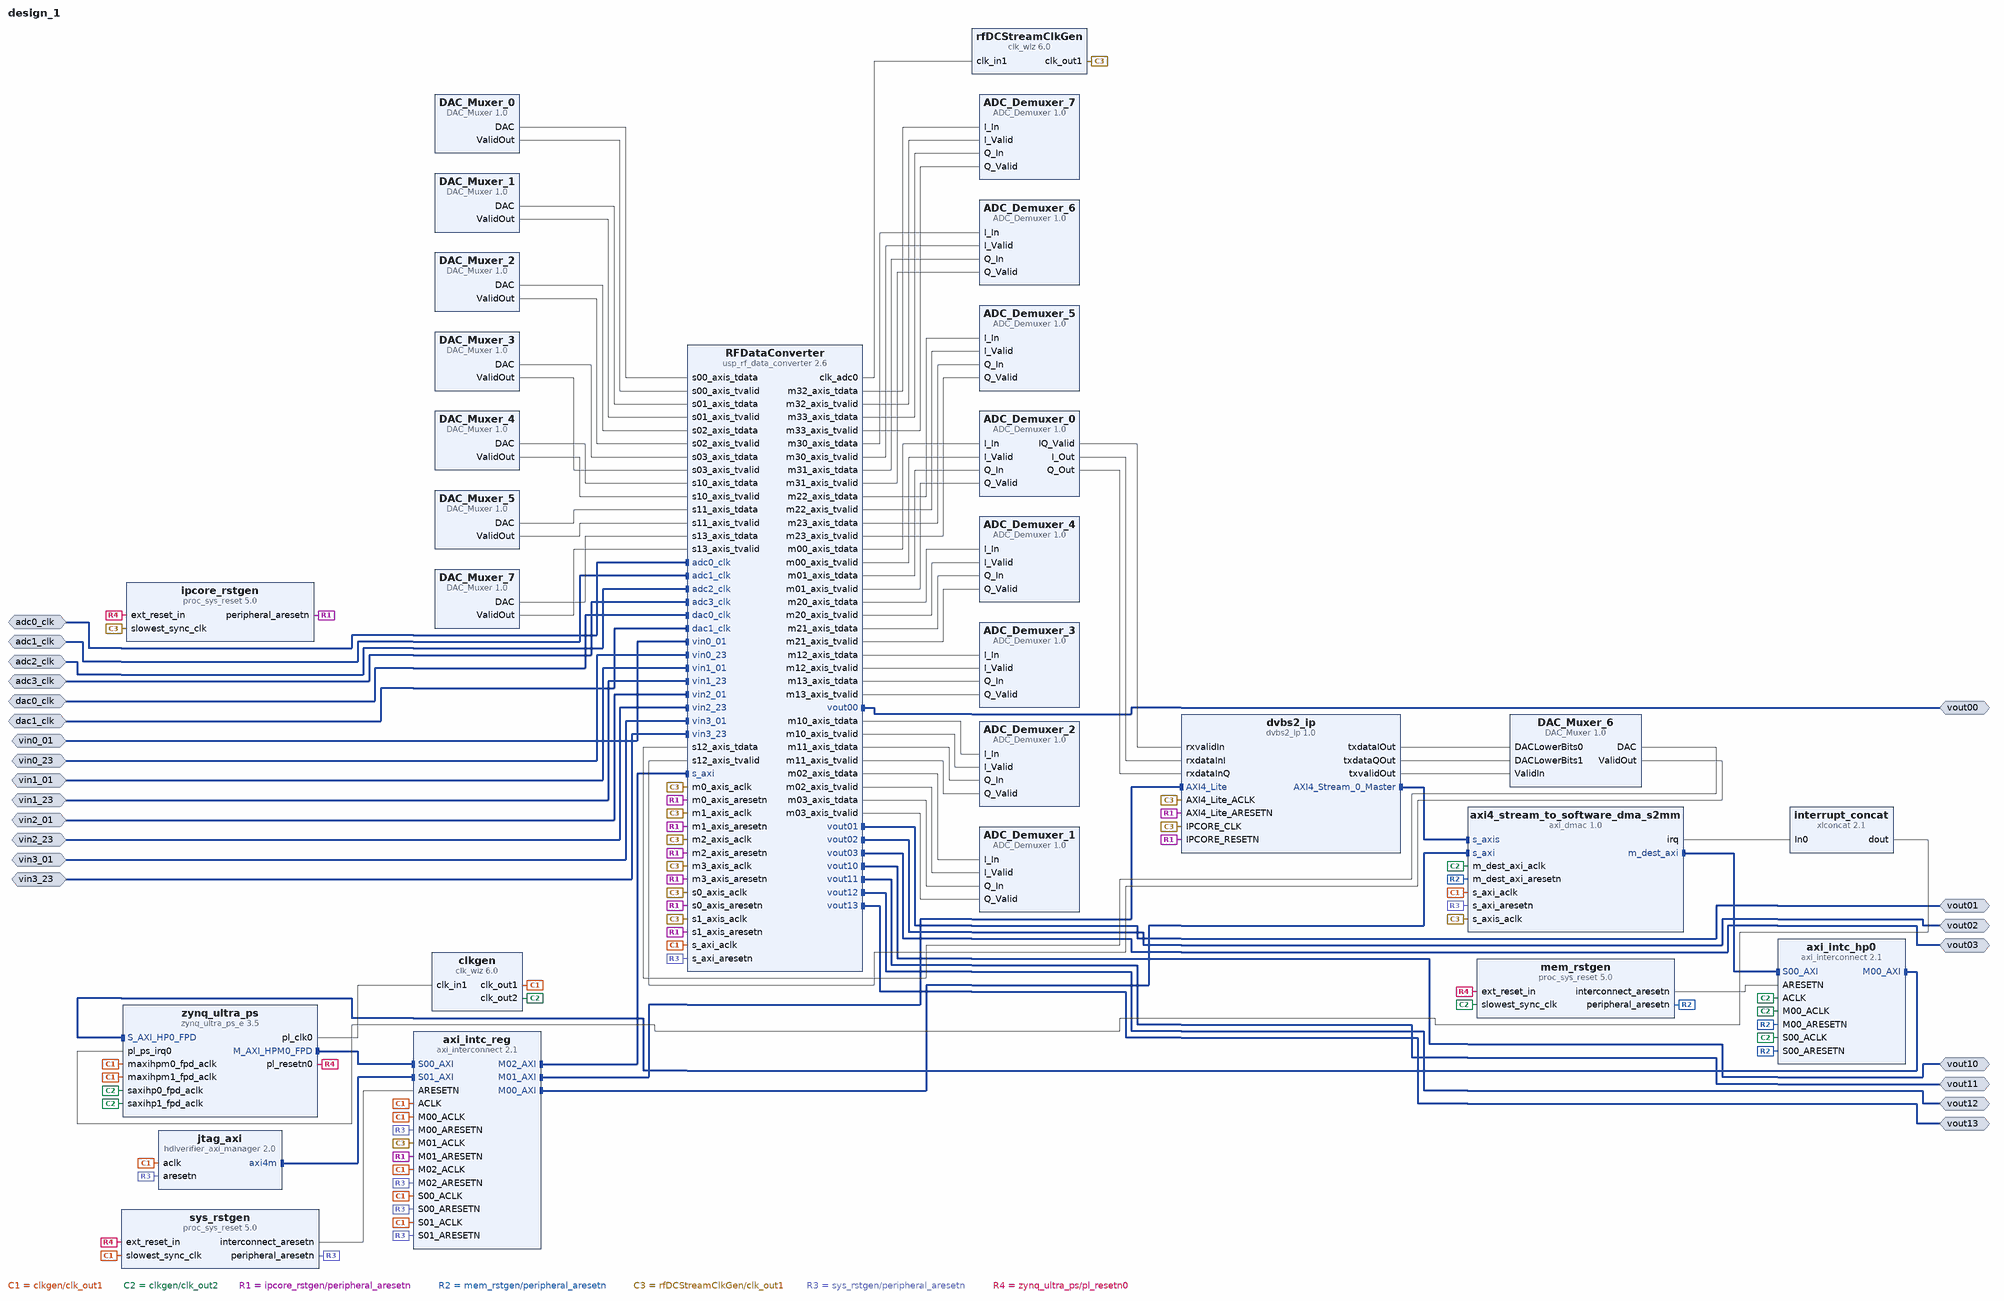
[diagram p0: block diagram of the top level]
# Vivado block design design_1, xczu28dr-ffvg1517-2-e, Vivado 2024.1
create_bd_design design_1

create_bd_intf_port -mode Slave -vlnv xilinx.com:interface:diff_clock_rtl:1.0 adc0_clk
create_bd_intf_port -mode Slave -vlnv xilinx.com:interface:diff_clock_rtl:1.0 adc1_clk
create_bd_intf_port -mode Slave -vlnv xilinx.com:interface:diff_clock_rtl:1.0 adc2_clk
create_bd_intf_port -mode Slave -vlnv xilinx.com:interface:diff_clock_rtl:1.0 adc3_clk
create_bd_intf_port -mode Slave -vlnv xilinx.com:interface:diff_analog_io_rtl:1.0 vin0_01
create_bd_intf_port -mode Slave -vlnv xilinx.com:interface:diff_analog_io_rtl:1.0 vin0_23
create_bd_intf_port -mode Slave -vlnv xilinx.com:interface:diff_analog_io_rtl:1.0 vin1_01
create_bd_intf_port -mode Slave -vlnv xilinx.com:interface:diff_analog_io_rtl:1.0 vin1_23
create_bd_intf_port -mode Slave -vlnv xilinx.com:interface:diff_analog_io_rtl:1.0 vin2_01
create_bd_intf_port -mode Slave -vlnv xilinx.com:interface:diff_analog_io_rtl:1.0 vin2_23
create_bd_intf_port -mode Slave -vlnv xilinx.com:interface:diff_analog_io_rtl:1.0 vin3_01
create_bd_intf_port -mode Slave -vlnv xilinx.com:interface:diff_analog_io_rtl:1.0 vin3_23
create_bd_intf_port -mode Slave -vlnv xilinx.com:interface:diff_clock_rtl:1.0 dac0_clk
create_bd_intf_port -mode Slave -vlnv xilinx.com:interface:diff_clock_rtl:1.0 dac1_clk
create_bd_intf_port -mode Master -vlnv xilinx.com:interface:diff_analog_io_rtl:1.0 vout00
create_bd_intf_port -mode Master -vlnv xilinx.com:interface:diff_analog_io_rtl:1.0 vout01
create_bd_intf_port -mode Master -vlnv xilinx.com:interface:diff_analog_io_rtl:1.0 vout02
create_bd_intf_port -mode Master -vlnv xilinx.com:interface:diff_analog_io_rtl:1.0 vout03
create_bd_intf_port -mode Master -vlnv xilinx.com:interface:diff_analog_io_rtl:1.0 vout10
create_bd_intf_port -mode Master -vlnv xilinx.com:interface:diff_analog_io_rtl:1.0 vout11
create_bd_intf_port -mode Master -vlnv xilinx.com:interface:diff_analog_io_rtl:1.0 vout12
create_bd_intf_port -mode Master -vlnv xilinx.com:interface:diff_analog_io_rtl:1.0 vout13

create_bd_cell -type ip -vlnv xilinx.com:ip:zynq_ultra_ps_e:3.5 zynq_ultra_ps
set_property -dict [list \
  CONFIG.CAN0_BOARD_INTERFACE custom \
  CONFIG.CAN1_BOARD_INTERFACE custom \
  CONFIG.CSU_BOARD_INTERFACE custom \
  CONFIG.DP_BOARD_INTERFACE custom \
  CONFIG.GEM0_BOARD_INTERFACE custom \
  CONFIG.GEM1_BOARD_INTERFACE custom \
  CONFIG.GEM2_BOARD_INTERFACE custom \
  CONFIG.GEM3_BOARD_INTERFACE custom \
  CONFIG.GPIO_BOARD_INTERFACE custom \
  CONFIG.IIC0_BOARD_INTERFACE custom \
  CONFIG.IIC1_BOARD_INTERFACE custom \
  CONFIG.NAND_BOARD_INTERFACE custom \
  CONFIG.PCIE_BOARD_INTERFACE custom \
  CONFIG.PJTAG_BOARD_INTERFACE custom \
  CONFIG.PMU_BOARD_INTERFACE custom \
  CONFIG.PSU_BANK_0_IO_STANDARD LVCMOS18 \
  CONFIG.PSU_BANK_1_IO_STANDARD LVCMOS18 \
  CONFIG.PSU_BANK_2_IO_STANDARD LVCMOS18 \
  CONFIG.PSU_BANK_3_IO_STANDARD LVCMOS33 \
  CONFIG.PSU_USB3__DUAL_CLOCK_ENABLE 1 \
  CONFIG.PSU__CAN1__PERIPHERAL__ENABLE 0 \
  CONFIG.PSU__CRF_APB__ACPU_CTRL__FREQMHZ 1200 \
  CONFIG.PSU__CRF_APB__ACPU_CTRL__SRCSEL APLL \
  CONFIG.PSU__CRF_APB__APLL_CTRL__SRCSEL PSS_REF_CLK \
  CONFIG.PSU__CRF_APB__DBG_FPD_CTRL__FREQMHZ 250 \
  CONFIG.PSU__CRF_APB__DBG_FPD_CTRL__SRCSEL IOPLL \
  CONFIG.PSU__CRF_APB__DBG_TRACE_CTRL__FREQMHZ 250 \
  CONFIG.PSU__CRF_APB__DBG_TRACE_CTRL__SRCSEL IOPLL \
  CONFIG.PSU__CRF_APB__DBG_TSTMP_CTRL__FREQMHZ 250 \
  CONFIG.PSU__CRF_APB__DBG_TSTMP_CTRL__SRCSEL IOPLL \
  CONFIG.PSU__CRF_APB__DDR_CTRL__FREQMHZ 1067 \
  CONFIG.PSU__CRF_APB__DDR_CTRL__SRCSEL DPLL \
  CONFIG.PSU__CRF_APB__DPDMA_REF_CTRL__FREQMHZ 600 \
  CONFIG.PSU__CRF_APB__DPDMA_REF_CTRL__SRCSEL APLL \
  CONFIG.PSU__CRF_APB__DPLL_CTRL__SRCSEL PSS_REF_CLK \
  CONFIG.PSU__CRF_APB__DP_AUDIO_REF_CTRL__SRCSEL RPLL \
  CONFIG.PSU__CRF_APB__DP_STC_REF_CTRL__SRCSEL RPLL \
  CONFIG.PSU__CRF_APB__DP_VIDEO_REF_CTRL__SRCSEL VPLL \
  CONFIG.PSU__CRF_APB__GDMA_REF_CTRL__FREQMHZ 600 \
  CONFIG.PSU__CRF_APB__GDMA_REF_CTRL__SRCSEL APLL \
  CONFIG.PSU__CRF_APB__GPU_REF_CTRL__FREQMHZ 500 \
  CONFIG.PSU__CRF_APB__GPU_REF_CTRL__SRCSEL IOPLL \
  CONFIG.PSU__CRF_APB__TOPSW_LSBUS_CTRL__FREQMHZ 100 \
  CONFIG.PSU__CRF_APB__TOPSW_LSBUS_CTRL__SRCSEL IOPLL \
  CONFIG.PSU__CRF_APB__TOPSW_MAIN_CTRL__FREQMHZ 533.33 \
  CONFIG.PSU__CRF_APB__TOPSW_MAIN_CTRL__SRCSEL DPLL \
  CONFIG.PSU__CRF_APB__VPLL_CTRL__SRCSEL PSS_REF_CLK \
  CONFIG.PSU__CRL_APB__ADMA_REF_CTRL__FREQMHZ 500 \
  CONFIG.PSU__CRL_APB__ADMA_REF_CTRL__SRCSEL IOPLL \
  CONFIG.PSU__CRL_APB__CAN1_REF_CTRL__FREQMHZ 100 \
  CONFIG.PSU__CRL_APB__CAN1_REF_CTRL__SRCSEL IOPLL \
  CONFIG.PSU__CRL_APB__CPU_R5_CTRL__FREQMHZ 500 \
  CONFIG.PSU__CRL_APB__CPU_R5_CTRL__SRCSEL IOPLL \
  CONFIG.PSU__CRL_APB__DBG_LPD_CTRL__FREQMHZ 250 \
  CONFIG.PSU__CRL_APB__DBG_LPD_CTRL__SRCSEL IOPLL \
  CONFIG.PSU__CRL_APB__GEM3_REF_CTRL__FREQMHZ 125 \
  CONFIG.PSU__CRL_APB__GEM3_REF_CTRL__SRCSEL IOPLL \
  CONFIG.PSU__CRL_APB__I2C0_REF_CTRL__FREQMHZ 100 \
  CONFIG.PSU__CRL_APB__I2C0_REF_CTRL__SRCSEL IOPLL \
  CONFIG.PSU__CRL_APB__I2C1_REF_CTRL__FREQMHZ 100 \
  CONFIG.PSU__CRL_APB__I2C1_REF_CTRL__SRCSEL IOPLL \
  CONFIG.PSU__CRL_APB__IOPLL_CTRL__SRCSEL PSS_REF_CLK \
  CONFIG.PSU__CRL_APB__IOU_SWITCH_CTRL__FREQMHZ 250 \
  CONFIG.PSU__CRL_APB__IOU_SWITCH_CTRL__SRCSEL IOPLL \
  CONFIG.PSU__CRL_APB__LPD_LSBUS_CTRL__FREQMHZ 100 \
  CONFIG.PSU__CRL_APB__LPD_LSBUS_CTRL__SRCSEL IOPLL \
  CONFIG.PSU__CRL_APB__LPD_SWITCH_CTRL__FREQMHZ 500 \
  CONFIG.PSU__CRL_APB__LPD_SWITCH_CTRL__SRCSEL IOPLL \
  CONFIG.PSU__CRL_APB__PCAP_CTRL__FREQMHZ 200 \
  CONFIG.PSU__CRL_APB__PCAP_CTRL__SRCSEL IOPLL \
  CONFIG.PSU__CRL_APB__PL0_REF_CTRL__FREQMHZ 100 \
  CONFIG.PSU__CRL_APB__PL0_REF_CTRL__SRCSEL IOPLL \
  CONFIG.PSU__CRL_APB__QSPI_REF_CTRL__FREQMHZ 125 \
  CONFIG.PSU__CRL_APB__QSPI_REF_CTRL__SRCSEL IOPLL \
  CONFIG.PSU__CRL_APB__RPLL_CTRL__SRCSEL PSS_REF_CLK \
  CONFIG.PSU__CRL_APB__SDIO1_REF_CTRL__FREQMHZ 200 \
  CONFIG.PSU__CRL_APB__SDIO1_REF_CTRL__SRCSEL IOPLL \
  CONFIG.PSU__CRL_APB__TIMESTAMP_REF_CTRL__FREQMHZ 100 \
  CONFIG.PSU__CRL_APB__TIMESTAMP_REF_CTRL__SRCSEL IOPLL \
  CONFIG.PSU__CRL_APB__UART0_REF_CTRL__FREQMHZ 100 \
  CONFIG.PSU__CRL_APB__UART0_REF_CTRL__SRCSEL IOPLL \
  CONFIG.PSU__CRL_APB__UART1_REF_CTRL__FREQMHZ 100 \
  CONFIG.PSU__CRL_APB__UART1_REF_CTRL__SRCSEL IOPLL \
  CONFIG.PSU__CRL_APB__USB0_BUS_REF_CTRL__FREQMHZ 250 \
  CONFIG.PSU__CRL_APB__USB0_BUS_REF_CTRL__SRCSEL IOPLL \
  CONFIG.PSU__CRL_APB__USB3_DUAL_REF_CTRL__FREQMHZ 20 \
  CONFIG.PSU__CRL_APB__USB3_DUAL_REF_CTRL__SRCSEL IOPLL \
  CONFIG.PSU__CRL_APB__USB3__ENABLE 1 \
  CONFIG.PSU__CSUPMU__PERIPHERAL__VALID 1 \
  CONFIG.PSU__DDRC__BUS_WIDTH {64 Bit} \
  CONFIG.PSU__DDRC__COMPONENTS UDIMM \
  CONFIG.PSU__DDRC__DEVICE_CAPACITY {8192 MBits} \
  CONFIG.PSU__DDRC__DRAM_WIDTH {16 Bits} \
  CONFIG.PSU__DDRC__ECC Disabled \
  CONFIG.PSU__DDRC__MEMORY_TYPE {DDR 4} \
  CONFIG.PSU__DDRC__SPEED_BIN DDR4_2133P \
  CONFIG.PSU__DDR_HIGH_ADDRESS_GUI_ENABLE 1 \
  CONFIG.PSU__DDR__INTERFACE__FREQMHZ 533.500 \
  CONFIG.PSU__DEVICE_TYPE RFSOC \
  CONFIG.PSU__DISPLAYPORT__LANE0__ENABLE 1 \
  CONFIG.PSU__DISPLAYPORT__LANE0__IO {GT Lane1} \
  CONFIG.PSU__DISPLAYPORT__LANE1__ENABLE 1 \
  CONFIG.PSU__DISPLAYPORT__LANE1__IO {GT Lane0} \
  CONFIG.PSU__DISPLAYPORT__PERIPHERAL__ENABLE 1 \
  CONFIG.PSU__DLL__ISUSED 1 \
  CONFIG.PSU__DPAUX__PERIPHERAL__ENABLE 1 \
  CONFIG.PSU__DPAUX__PERIPHERAL__IO {MIO 27 .. 30} \
  CONFIG.PSU__DP__LANE_SEL {Dual Lower} \
  CONFIG.PSU__DP__REF_CLK_FREQ 27 \
  CONFIG.PSU__DP__REF_CLK_SEL {Ref Clk1} \
  CONFIG.PSU__ENET3__FIFO__ENABLE 0 \
  CONFIG.PSU__ENET3__GRP_MDIO__ENABLE 1 \
  CONFIG.PSU__ENET3__GRP_MDIO__IO {MIO 76 .. 77} \
  CONFIG.PSU__ENET3__PERIPHERAL__ENABLE 1 \
  CONFIG.PSU__ENET3__PERIPHERAL__IO {MIO 64 .. 75} \
  CONFIG.PSU__ENET3__PTP__ENABLE 0 \
  CONFIG.PSU__ENET3__TSU__ENABLE 0 \
  CONFIG.PSU__FPGA_PL0_ENABLE 1 \
  CONFIG.PSU__GEM3_COHERENCY 0 \
  CONFIG.PSU__GEM3_ROUTE_THROUGH_FPD 0 \
  CONFIG.PSU__GEM__TSU__ENABLE 0 \
  CONFIG.PSU__GPIO0_MIO__IO {MIO 0 .. 25} \
  CONFIG.PSU__GPIO0_MIO__PERIPHERAL__ENABLE 1 \
  CONFIG.PSU__GPIO1_MIO__IO {MIO 26 .. 51} \
  CONFIG.PSU__GPIO1_MIO__PERIPHERAL__ENABLE 1 \
  CONFIG.PSU__GPU_PP0__POWER__ON 0 \
  CONFIG.PSU__GPU_PP1__POWER__ON 0 \
  CONFIG.PSU__GT__LINK_SPEED HBR \
  CONFIG.PSU__GT__PRE_EMPH_LVL_4 0 \
  CONFIG.PSU__GT__VLT_SWNG_LVL_4 0 \
  CONFIG.PSU__I2C0__PERIPHERAL__ENABLE 1 \
  CONFIG.PSU__I2C0__PERIPHERAL__IO {MIO 14 .. 15} \
  CONFIG.PSU__I2C1__PERIPHERAL__ENABLE 1 \
  CONFIG.PSU__I2C1__PERIPHERAL__IO {MIO 16 .. 17} \
  CONFIG.PSU__IOU_SLCR__IOU_TTC_APB_CLK__TTC0_SEL APB \
  CONFIG.PSU__IOU_SLCR__IOU_TTC_APB_CLK__TTC1_SEL APB \
  CONFIG.PSU__IOU_SLCR__IOU_TTC_APB_CLK__TTC2_SEL APB \
  CONFIG.PSU__IOU_SLCR__IOU_TTC_APB_CLK__TTC3_SEL APB \
  CONFIG.PSU__MAXIGP0__DATA_WIDTH 128 \
  CONFIG.PSU__OVERRIDE__BASIC_CLOCK 0 \
  CONFIG.PSU__PCIE__CLASS_CODE_BASE 0x06 \
  CONFIG.PSU__PCIE__CLASS_CODE_INTERFACE 0x0 \
  CONFIG.PSU__PCIE__CLASS_CODE_SUB 0x4 \
  CONFIG.PSU__PCIE__DEVICE_ID 0xD021 \
  CONFIG.PSU__PCIE__REVISION_ID 0x0 \
  CONFIG.PSU__PCIE__SUBSYSTEM_ID 0x7 \
  CONFIG.PSU__PCIE__SUBSYSTEM_VENDOR_ID 0x10EE \
  CONFIG.PSU__PCIE__VENDOR_ID 0x10EE \
  CONFIG.PSU__PMU_COHERENCY 0 \
  CONFIG.PSU__PMU__AIBACK__ENABLE 0 \
  CONFIG.PSU__PMU__EMIO_GPI__ENABLE 0 \
  CONFIG.PSU__PMU__EMIO_GPO__ENABLE 0 \
  CONFIG.PSU__PMU__GPI0__ENABLE 0 \
  CONFIG.PSU__PMU__GPI1__ENABLE 0 \
  CONFIG.PSU__PMU__GPI2__ENABLE 0 \
  CONFIG.PSU__PMU__GPI3__ENABLE 0 \
  CONFIG.PSU__PMU__GPI4__ENABLE 0 \
  CONFIG.PSU__PMU__GPI5__ENABLE 0 \
  CONFIG.PSU__PMU__GPO0__ENABLE 1 \
  CONFIG.PSU__PMU__GPO0__IO {MIO 32} \
  CONFIG.PSU__PMU__GPO1__ENABLE 1 \
  CONFIG.PSU__PMU__GPO1__IO {MIO 33} \
  CONFIG.PSU__PMU__GPO2__ENABLE 1 \
  CONFIG.PSU__PMU__GPO2__IO {MIO 34} \
  CONFIG.PSU__PMU__GPO2__POLARITY low \
  CONFIG.PSU__PMU__GPO3__ENABLE 1 \
  CONFIG.PSU__PMU__GPO3__IO {MIO 35} \
  CONFIG.PSU__PMU__GPO3__POLARITY low \
  CONFIG.PSU__PMU__GPO4__ENABLE 1 \
  CONFIG.PSU__PMU__GPO4__IO {MIO 36} \
  CONFIG.PSU__PMU__GPO4__POLARITY low \
  CONFIG.PSU__PMU__GPO5__ENABLE 1 \
  CONFIG.PSU__PMU__GPO5__IO {MIO 37} \
  CONFIG.PSU__PMU__GPO5__POLARITY low \
  CONFIG.PSU__PMU__PERIPHERAL__ENABLE 1 \
  CONFIG.PSU__PMU__PLERROR__ENABLE 0 \
  CONFIG.PSU__PRESET_APPLIED 1 \
  CONFIG.PSU__PSS_REF_CLK__FREQMHZ 33.333 \
  CONFIG.PSU__QSPI_COHERENCY 0 \
  CONFIG.PSU__QSPI_ROUTE_THROUGH_FPD 0 \
  CONFIG.PSU__QSPI__GRP_FBCLK__ENABLE 1 \
  CONFIG.PSU__QSPI__GRP_FBCLK__IO {MIO 6} \
  CONFIG.PSU__QSPI__PERIPHERAL__DATA_MODE x4 \
  CONFIG.PSU__QSPI__PERIPHERAL__ENABLE 1 \
  CONFIG.PSU__QSPI__PERIPHERAL__IO {MIO 0 .. 12} \
  CONFIG.PSU__QSPI__PERIPHERAL__MODE {Dual Parallel} \
  CONFIG.PSU__SATA__LANE1__IO {GT Lane3} \
  CONFIG.PSU__SATA__PERIPHERAL__ENABLE 1 \
  CONFIG.PSU__SATA__REF_CLK_FREQ 125 \
  CONFIG.PSU__SATA__REF_CLK_SEL {Ref Clk3} \
  CONFIG.PSU__SD1_COHERENCY 0 \
  CONFIG.PSU__SD1_ROUTE_THROUGH_FPD 0 \
  CONFIG.PSU__SD1__CLK_100_SDR_OTAP_DLY 0x3 \
  CONFIG.PSU__SD1__CLK_200_SDR_OTAP_DLY 0x3 \
  CONFIG.PSU__SD1__CLK_50_DDR_ITAP_DLY 0x3D \
  CONFIG.PSU__SD1__CLK_50_DDR_OTAP_DLY 0x4 \
  CONFIG.PSU__SD1__CLK_50_SDR_ITAP_DLY 0x15 \
  CONFIG.PSU__SD1__CLK_50_SDR_OTAP_DLY 0x5 \
  CONFIG.PSU__SD1__DATA_TRANSFER_MODE 8Bit \
  CONFIG.PSU__SD1__GRP_CD__ENABLE 1 \
  CONFIG.PSU__SD1__GRP_CD__IO {MIO 45} \
  CONFIG.PSU__SD1__GRP_POW__ENABLE 0 \
  CONFIG.PSU__SD1__GRP_WP__ENABLE 0 \
  CONFIG.PSU__SD1__PERIPHERAL__ENABLE 1 \
  CONFIG.PSU__SD1__PERIPHERAL__IO {MIO 39 .. 51} \
  CONFIG.PSU__SD1__SLOT_TYPE {SD 3.0} \
  CONFIG.PSU__SWDT0__CLOCK__ENABLE 0 \
  CONFIG.PSU__SWDT0__PERIPHERAL__ENABLE 1 \
  CONFIG.PSU__SWDT0__RESET__ENABLE 0 \
  CONFIG.PSU__SWDT1__CLOCK__ENABLE 0 \
  CONFIG.PSU__SWDT1__PERIPHERAL__ENABLE 1 \
  CONFIG.PSU__SWDT1__RESET__ENABLE 0 \
  CONFIG.PSU__TSU__BUFG_PORT_PAIR 0 \
  CONFIG.PSU__TTC0__CLOCK__ENABLE 0 \
  CONFIG.PSU__TTC0__PERIPHERAL__ENABLE 1 \
  CONFIG.PSU__TTC0__WAVEOUT__ENABLE 0 \
  CONFIG.PSU__TTC1__CLOCK__ENABLE 0 \
  CONFIG.PSU__TTC1__PERIPHERAL__ENABLE 1 \
  CONFIG.PSU__TTC1__WAVEOUT__ENABLE 0 \
  CONFIG.PSU__TTC2__CLOCK__ENABLE 0 \
  CONFIG.PSU__TTC2__PERIPHERAL__ENABLE 1 \
  CONFIG.PSU__TTC2__WAVEOUT__ENABLE 0 \
  CONFIG.PSU__TTC3__CLOCK__ENABLE 0 \
  CONFIG.PSU__TTC3__PERIPHERAL__ENABLE 1 \
  CONFIG.PSU__TTC3__WAVEOUT__ENABLE 0 \
  CONFIG.PSU__UART0__BAUD_RATE 115200 \
  CONFIG.PSU__UART0__MODEM__ENABLE 0 \
  CONFIG.PSU__UART0__PERIPHERAL__ENABLE 1 \
  CONFIG.PSU__UART0__PERIPHERAL__IO {MIO 18 .. 19} \
  CONFIG.PSU__UART1__PERIPHERAL__ENABLE 0 \
  CONFIG.PSU__USB0_COHERENCY 0 \
  CONFIG.PSU__USB0__PERIPHERAL__ENABLE 1 \
  CONFIG.PSU__USB0__PERIPHERAL__IO {MIO 52 .. 63} \
  CONFIG.PSU__USB0__REF_CLK_FREQ 26 \
  CONFIG.PSU__USB0__REF_CLK_SEL {Ref Clk2} \
  CONFIG.PSU__USB2_0__EMIO__ENABLE 0 \
  CONFIG.PSU__USB3_0__EMIO__ENABLE 0 \
  CONFIG.PSU__USB3_0__PERIPHERAL__ENABLE 1 \
  CONFIG.PSU__USB3_0__PERIPHERAL__IO {GT Lane2} \
  CONFIG.PSU__USB__RESET__MODE {Boot Pin} \
  CONFIG.PSU__USB__RESET__POLARITY {Active Low} \
  CONFIG.PSU__USE__IRQ0 1 \
  CONFIG.PSU__USE__IRQ1 1 \
  CONFIG.PSU__USE__M_AXI_GP0 1 \
  CONFIG.PSU__USE__M_AXI_GP1 1 \
  CONFIG.PSU__USE__M_AXI_GP2 0 \
  CONFIG.PSU__USE__S_AXI_GP2 1 \
  CONFIG.PSU__USE__S_AXI_GP3 1 \
  CONFIG.QSPI_BOARD_INTERFACE custom \
  CONFIG.SATA_BOARD_INTERFACE custom \
  CONFIG.SD0_BOARD_INTERFACE custom \
  CONFIG.SD1_BOARD_INTERFACE custom \
  CONFIG.SPI0_BOARD_INTERFACE custom \
  CONFIG.SPI1_BOARD_INTERFACE custom \
  CONFIG.SUBPRESET1 Custom \
  CONFIG.SUBPRESET2 Custom \
  CONFIG.SWDT0_BOARD_INTERFACE custom \
  CONFIG.SWDT1_BOARD_INTERFACE custom \
  CONFIG.TRACE_BOARD_INTERFACE custom \
  CONFIG.TTC0_BOARD_INTERFACE custom \
  CONFIG.TTC1_BOARD_INTERFACE custom \
  CONFIG.TTC2_BOARD_INTERFACE custom \
  CONFIG.TTC3_BOARD_INTERFACE custom \
  CONFIG.UART0_BOARD_INTERFACE custom \
  CONFIG.UART1_BOARD_INTERFACE custom \
  CONFIG.USB0_BOARD_INTERFACE custom \
  CONFIG.USB1_BOARD_INTERFACE custom \
] [get_bd_cells zynq_ultra_ps]
# 736 more settings of zynq_ultra_ps are not shown: defaults, MIO pin electricals, DDR timing, and values the tool derives
create_bd_cell -type ip -vlnv xilinx.com:ip:usp_rf_data_converter:2.6 RFDataConverter
set_property -dict [list \
  CONFIG.ADC0_Multi_Tile_Sync false \
  CONFIG.ADC0_Outclk_Freq 128.000 \
  CONFIG.ADC0_PLL_Enable true \
  CONFIG.ADC0_Sampling_Rate 2.04800000 \
  CONFIG.ADC1_Outclk_Freq 128.000 \
  CONFIG.ADC1_PLL_Enable true \
  CONFIG.ADC1_Sampling_Rate 2.04800000 \
  CONFIG.ADC2_Outclk_Freq 128.000 \
  CONFIG.ADC2_PLL_Enable true \
  CONFIG.ADC2_Sampling_Rate 2.04800000 \
  CONFIG.ADC3_Outclk_Freq 128.000 \
  CONFIG.ADC3_PLL_Enable true \
  CONFIG.ADC3_Sampling_Rate 2.04800000 \
  CONFIG.ADC_Data_Type00 1 \
  CONFIG.ADC_Data_Type02 1 \
  CONFIG.ADC_Data_Type10 1 \
  CONFIG.ADC_Data_Type12 1 \
  CONFIG.ADC_Data_Type20 1 \
  CONFIG.ADC_Data_Type22 1 \
  CONFIG.ADC_Data_Type30 1 \
  CONFIG.ADC_Data_Type32 1 \
  CONFIG.ADC_Data_Width00 4 \
  CONFIG.ADC_Data_Width02 4 \
  CONFIG.ADC_Data_Width10 4 \
  CONFIG.ADC_Data_Width12 4 \
  CONFIG.ADC_Data_Width20 4 \
  CONFIG.ADC_Data_Width22 4 \
  CONFIG.ADC_Data_Width30 4 \
  CONFIG.ADC_Data_Width32 4 \
  CONFIG.ADC_Decimation_Mode00 4 \
  CONFIG.ADC_Decimation_Mode02 4 \
  CONFIG.ADC_Decimation_Mode10 4 \
  CONFIG.ADC_Decimation_Mode12 4 \
  CONFIG.ADC_Decimation_Mode20 4 \
  CONFIG.ADC_Decimation_Mode22 4 \
  CONFIG.ADC_Decimation_Mode30 4 \
  CONFIG.ADC_Decimation_Mode32 4 \
  CONFIG.ADC_Mixer_Mode00 0 \
  CONFIG.ADC_Mixer_Mode02 0 \
  CONFIG.ADC_Mixer_Mode10 0 \
  CONFIG.ADC_Mixer_Mode12 0 \
  CONFIG.ADC_Mixer_Mode20 0 \
  CONFIG.ADC_Mixer_Mode22 0 \
  CONFIG.ADC_Mixer_Mode30 0 \
  CONFIG.ADC_Mixer_Mode32 0 \
  CONFIG.ADC_Mixer_Type00 2 \
  CONFIG.ADC_Mixer_Type02 2 \
  CONFIG.ADC_Mixer_Type10 2 \
  CONFIG.ADC_Mixer_Type12 2 \
  CONFIG.ADC_Mixer_Type20 2 \
  CONFIG.ADC_Mixer_Type22 2 \
  CONFIG.ADC_Mixer_Type30 2 \
  CONFIG.ADC_Mixer_Type32 2 \
  CONFIG.ADC_NCO_Freq00 -0.86 \
  CONFIG.ADC_NCO_Freq02 0 \
  CONFIG.ADC_NCO_Freq10 0 \
  CONFIG.ADC_NCO_Freq12 0 \
  CONFIG.ADC_NCO_Freq20 0 \
  CONFIG.ADC_NCO_Freq22 0 \
  CONFIG.ADC_NCO_Freq30 0 \
  CONFIG.ADC_NCO_Freq32 0 \
  CONFIG.ADC_NCO_Phase00 0 \
  CONFIG.ADC_NCO_Phase02 0 \
  CONFIG.ADC_NCO_Phase10 0 \
  CONFIG.ADC_NCO_Phase12 0 \
  CONFIG.ADC_NCO_Phase20 0 \
  CONFIG.ADC_NCO_Phase22 0 \
  CONFIG.ADC_NCO_Phase30 0 \
  CONFIG.ADC_NCO_Phase32 0 \
  CONFIG.ADC_NCO_RTS false \
  CONFIG.ADC_RTS false \
  CONFIG.ADC_Slice00_Enable true \
  CONFIG.ADC_Slice02_Enable true \
  CONFIG.ADC_Slice10_Enable true \
  CONFIG.ADC_Slice12_Enable true \
  CONFIG.ADC_Slice20_Enable true \
  CONFIG.ADC_Slice22_Enable true \
  CONFIG.ADC_Slice30_Enable true \
  CONFIG.ADC_Slice32_Enable true \
  CONFIG.Axiclk_Freq 50 \
  CONFIG.DAC0_Multi_Tile_Sync false \
  CONFIG.DAC0_Outclk_Freq 128.000 \
  CONFIG.DAC0_PLL_Enable true \
  CONFIG.DAC0_Sampling_Rate 2.04800000 \
  CONFIG.DAC1_Outclk_Freq 128.000 \
  CONFIG.DAC1_PLL_Enable true \
  CONFIG.DAC1_Sampling_Rate 2.04800000 \
  CONFIG.DAC_Data_Type00 0 \
  CONFIG.DAC_Data_Type01 0 \
  CONFIG.DAC_Data_Type02 0 \
  CONFIG.DAC_Data_Type03 0 \
  CONFIG.DAC_Data_Type10 0 \
  CONFIG.DAC_Data_Type11 0 \
  CONFIG.DAC_Data_Type12 0 \
  CONFIG.DAC_Data_Type13 0 \
  CONFIG.DAC_Data_Width00 8 \
  CONFIG.DAC_Data_Width01 8 \
  CONFIG.DAC_Data_Width02 8 \
  CONFIG.DAC_Data_Width03 8 \
  CONFIG.DAC_Data_Width10 8 \
  CONFIG.DAC_Data_Width11 8 \
  CONFIG.DAC_Data_Width12 8 \
  CONFIG.DAC_Data_Width13 8 \
  CONFIG.DAC_Interpolation_Mode00 4 \
  CONFIG.DAC_Interpolation_Mode01 4 \
  CONFIG.DAC_Interpolation_Mode02 4 \
  CONFIG.DAC_Interpolation_Mode03 4 \
  CONFIG.DAC_Interpolation_Mode10 4 \
  CONFIG.DAC_Interpolation_Mode11 4 \
  CONFIG.DAC_Interpolation_Mode12 4 \
  CONFIG.DAC_Interpolation_Mode13 4 \
  CONFIG.DAC_Invsinc_Ctrl00 false \
  CONFIG.DAC_Invsinc_Ctrl01 false \
  CONFIG.DAC_Invsinc_Ctrl02 false \
  CONFIG.DAC_Invsinc_Ctrl03 false \
  CONFIG.DAC_Invsinc_Ctrl10 false \
  CONFIG.DAC_Invsinc_Ctrl11 false \
  CONFIG.DAC_Invsinc_Ctrl12 false \
  CONFIG.DAC_Invsinc_Ctrl13 false \
  CONFIG.DAC_Mixer_Mode00 0 \
  CONFIG.DAC_Mixer_Mode01 0 \
  CONFIG.DAC_Mixer_Mode02 0 \
  CONFIG.DAC_Mixer_Mode03 0 \
  CONFIG.DAC_Mixer_Mode10 0 \
  CONFIG.DAC_Mixer_Mode11 0 \
  CONFIG.DAC_Mixer_Mode12 0 \
  CONFIG.DAC_Mixer_Mode13 0 \
  CONFIG.DAC_Mixer_Type00 2 \
  CONFIG.DAC_Mixer_Type01 2 \
  CONFIG.DAC_Mixer_Type02 2 \
  CONFIG.DAC_Mixer_Type03 2 \
  CONFIG.DAC_Mixer_Type10 2 \
  CONFIG.DAC_Mixer_Type11 2 \
  CONFIG.DAC_Mixer_Type12 2 \
  CONFIG.DAC_Mixer_Type13 2 \
  CONFIG.DAC_NCO_Freq00 0.86 \
  CONFIG.DAC_NCO_Freq01 0.86 \
  CONFIG.DAC_NCO_Freq02 0.86 \
  CONFIG.DAC_NCO_Freq03 0.86 \
  CONFIG.DAC_NCO_Freq10 0.86 \
  CONFIG.DAC_NCO_Freq11 0.86 \
  CONFIG.DAC_NCO_Freq12 0.86 \
  CONFIG.DAC_NCO_Freq13 0.86 \
  CONFIG.DAC_NCO_Phase00 0 \
  CONFIG.DAC_NCO_Phase01 0 \
  CONFIG.DAC_NCO_Phase02 0 \
  CONFIG.DAC_NCO_Phase03 0 \
  CONFIG.DAC_NCO_Phase10 0 \
  CONFIG.DAC_NCO_Phase11 0 \
  CONFIG.DAC_NCO_Phase12 0 \
  CONFIG.DAC_NCO_Phase13 0 \
  CONFIG.DAC_NCO_RTS false \
  CONFIG.DAC_Slice00_Enable true \
  CONFIG.DAC_Slice01_Enable true \
  CONFIG.DAC_Slice02_Enable true \
  CONFIG.DAC_Slice03_Enable true \
  CONFIG.DAC_Slice10_Enable true \
  CONFIG.DAC_Slice11_Enable true \
  CONFIG.DAC_Slice12_Enable true \
  CONFIG.DAC_Slice13_Enable true \
] [get_bd_cells RFDataConverter]
create_bd_cell -type ip -vlnv xilinx.com:ip:clk_wiz:6.0 rfDCStreamClkGen
set_property -dict [list \
  CONFIG.CLKOUT1_REQUESTED_OUT_FREQ 128 \
  CONFIG.USE_LOCKED false \
  CONFIG.USE_RESET false \
] [get_bd_cells rfDCStreamClkGen]
create_bd_cell -type ip -vlnv mathworks.com:user:DAC_Muxer:1.0 DAC_Muxer_0
set_property -dict {CONFIG.IQMODE true CONFIG.SAMPLESPERCLOCK 4} [get_bd_cells DAC_Muxer_0]
create_bd_cell -type ip -vlnv mathworks.com:user:DAC_Muxer:1.0 DAC_Muxer_1
set_property -dict {CONFIG.IQMODE true CONFIG.SAMPLESPERCLOCK 4} [get_bd_cells DAC_Muxer_1]
create_bd_cell -type ip -vlnv mathworks.com:user:DAC_Muxer:1.0 DAC_Muxer_2
set_property -dict {CONFIG.IQMODE true CONFIG.SAMPLESPERCLOCK 4} [get_bd_cells DAC_Muxer_2]
create_bd_cell -type ip -vlnv mathworks.com:user:DAC_Muxer:1.0 DAC_Muxer_3
set_property -dict {CONFIG.IQMODE true CONFIG.SAMPLESPERCLOCK 4} [get_bd_cells DAC_Muxer_3]
create_bd_cell -type ip -vlnv mathworks.com:user:DAC_Muxer:1.0 DAC_Muxer_4
set_property -dict {CONFIG.IQMODE true CONFIG.SAMPLESPERCLOCK 4} [get_bd_cells DAC_Muxer_4]
create_bd_cell -type ip -vlnv mathworks.com:user:DAC_Muxer:1.0 DAC_Muxer_5
set_property -dict {CONFIG.IQMODE true CONFIG.SAMPLESPERCLOCK 4} [get_bd_cells DAC_Muxer_5]
create_bd_cell -type ip -vlnv mathworks.com:user:DAC_Muxer:1.0 DAC_Muxer_6
set_property -dict {CONFIG.IQMODE true CONFIG.SAMPLESPERCLOCK 4} [get_bd_cells DAC_Muxer_6]
create_bd_cell -type ip -vlnv mathworks.com:user:DAC_Muxer:1.0 DAC_Muxer_7
set_property -dict {CONFIG.IQMODE true CONFIG.SAMPLESPERCLOCK 4} [get_bd_cells DAC_Muxer_7]
create_bd_cell -type ip -vlnv mathworks.com:user:ADC_Demuxer:1.0 ADC_Demuxer_0
set_property -dict {CONFIG.IQMODE true CONFIG.SAMPLESPERCLOCK 4} [get_bd_cells ADC_Demuxer_0]
create_bd_cell -type ip -vlnv mathworks.com:user:ADC_Demuxer:1.0 ADC_Demuxer_1
set_property -dict {CONFIG.IQMODE true CONFIG.SAMPLESPERCLOCK 4} [get_bd_cells ADC_Demuxer_1]
create_bd_cell -type ip -vlnv mathworks.com:user:ADC_Demuxer:1.0 ADC_Demuxer_2
set_property -dict {CONFIG.IQMODE true CONFIG.SAMPLESPERCLOCK 4} [get_bd_cells ADC_Demuxer_2]
create_bd_cell -type ip -vlnv mathworks.com:user:ADC_Demuxer:1.0 ADC_Demuxer_3
set_property -dict {CONFIG.IQMODE true CONFIG.SAMPLESPERCLOCK 4} [get_bd_cells ADC_Demuxer_3]
create_bd_cell -type ip -vlnv mathworks.com:user:ADC_Demuxer:1.0 ADC_Demuxer_4
set_property -dict {CONFIG.IQMODE true CONFIG.SAMPLESPERCLOCK 4} [get_bd_cells ADC_Demuxer_4]
create_bd_cell -type ip -vlnv mathworks.com:user:ADC_Demuxer:1.0 ADC_Demuxer_5
set_property -dict {CONFIG.IQMODE true CONFIG.SAMPLESPERCLOCK 4} [get_bd_cells ADC_Demuxer_5]
create_bd_cell -type ip -vlnv mathworks.com:user:ADC_Demuxer:1.0 ADC_Demuxer_6
set_property -dict {CONFIG.IQMODE true CONFIG.SAMPLESPERCLOCK 4} [get_bd_cells ADC_Demuxer_6]
create_bd_cell -type ip -vlnv mathworks.com:user:ADC_Demuxer:1.0 ADC_Demuxer_7
set_property -dict {CONFIG.IQMODE true CONFIG.SAMPLESPERCLOCK 4} [get_bd_cells ADC_Demuxer_7]
create_bd_cell -type ip -vlnv xilinx.com:ip:clk_wiz:6.0 clkgen
set_property -dict [list \
  CONFIG.CLKOUT1_REQUESTED_OUT_FREQ 50 \
  CONFIG.CLKOUT2_REQUESTED_OUT_FREQ 300 \
  CONFIG.CLKOUT2_USED true \
  CONFIG.PRIM_IN_FREQ 99.9990010000 \
  CONFIG.USE_LOCKED false \
  CONFIG.USE_RESET false \
] [get_bd_cells clkgen]
create_bd_cell -type ip -vlnv xilinx.com:ip:proc_sys_reset:5.0 sys_rstgen
set_property -dict {CONFIG.C_EXT_RST_WIDTH 1} [get_bd_cells sys_rstgen]
create_bd_cell -type ip -vlnv xilinx.com:ip:proc_sys_reset:5.0 ipcore_rstgen
set_property -dict {CONFIG.C_EXT_RST_WIDTH 1} [get_bd_cells ipcore_rstgen]
create_bd_cell -type ip -vlnv xilinx.com:ip:proc_sys_reset:5.0 mem_rstgen
set_property -dict {CONFIG.C_EXT_RST_WIDTH 1} [get_bd_cells mem_rstgen]
create_bd_cell -type ip -vlnv analog.com:user:axi_dmac:1.0 axi4_stream_to_software_dma_s2mm
set_property -dict [list \
  CONFIG.AXI_SLICE_DEST false \
  CONFIG.AXI_SLICE_SRC false \
  CONFIG.CYCLIC false \
  CONFIG.DMA_2D_TRANSFER false \
  CONFIG.DMA_AXI_PROTOCOL_DEST 0 \
  CONFIG.DMA_DATA_WIDTH_DEST 64 \
  CONFIG.DMA_DATA_WIDTH_SRC 32 \
  CONFIG.DMA_LENGTH_WIDTH 24 \
  CONFIG.DMA_TYPE_DEST 0 \
  CONFIG.DMA_TYPE_SRC 1 \
  CONFIG.ENABLE_DIAGNOSTICS_IF true \
  CONFIG.FIFO_SIZE 8 \
  CONFIG.ID 0 \
  CONFIG.MAX_BYTES_PER_BURST 1024 \
  CONFIG.SYNC_TRANSFER_START false \
] [get_bd_cells axi4_stream_to_software_dma_s2mm]
create_bd_cell -type ip -vlnv mathworks.com:ip:dvbs2_ip:1.0 dvbs2_ip
create_bd_cell -type ip -vlnv mathworks.com:ip:hdlverifier_axi_manager:2.0 jtag_axi
set_property -dict {CONFIG.AXI_ADDR_WIDTH 40 CONFIG.AXI_DATA_WIDTH 32 CONFIG.ID_WIDTH 1} [get_bd_cells jtag_axi]
create_bd_cell -type ip -vlnv xilinx.com:ip:axi_interconnect:2.1 axi_intc_reg
set_property -dict [list \
  CONFIG.ENABLE_ADVANCED_OPTIONS 1 \
  CONFIG.M00_HAS_REGSLICE 3 \
  CONFIG.M01_HAS_REGSLICE 3 \
  CONFIG.M02_HAS_REGSLICE 3 \
  CONFIG.NUM_MI 3 \
  CONFIG.NUM_SI 2 \
  CONFIG.S00_HAS_REGSLICE 3 \
  CONFIG.S01_HAS_REGSLICE 3 \
  CONFIG.XBAR_DATA_WIDTH 32 \
] [get_bd_cells axi_intc_reg]
create_bd_cell -type ip -vlnv xilinx.com:ip:axi_interconnect:2.1 axi_intc_hp0
set_property -dict [list \
  CONFIG.ENABLE_ADVANCED_OPTIONS 1 \
  CONFIG.M00_HAS_REGSLICE 3 \
  CONFIG.NUM_MI 1 \
  CONFIG.NUM_SI 1 \
  CONFIG.S00_HAS_REGSLICE 3 \
  CONFIG.XBAR_DATA_WIDTH 128 \
] [get_bd_cells axi_intc_hp0]
create_bd_cell -type ip -vlnv xilinx.com:ip:xlconcat:2.1 interrupt_concat
set_property -dict {CONFIG.NUM_PORTS 1} [get_bd_cells interrupt_concat]

# ---- connections ----

connect_bd_intf_net [get_bd_intf_ports vout00] [get_bd_intf_pins RFDataConverter/vout00]
connect_bd_intf_net [get_bd_intf_ports vout01] [get_bd_intf_pins RFDataConverter/vout01]
connect_bd_intf_net [get_bd_intf_ports vout02] [get_bd_intf_pins RFDataConverter/vout02]
connect_bd_intf_net [get_bd_intf_ports vout03] [get_bd_intf_pins RFDataConverter/vout03]
connect_bd_intf_net [get_bd_intf_ports vout10] [get_bd_intf_pins RFDataConverter/vout10]
connect_bd_intf_net [get_bd_intf_ports vout11] [get_bd_intf_pins RFDataConverter/vout11]
connect_bd_intf_net [get_bd_intf_ports vout12] [get_bd_intf_pins RFDataConverter/vout12]
connect_bd_intf_net [get_bd_intf_ports vout13] [get_bd_intf_pins RFDataConverter/vout13]
connect_bd_intf_net [get_bd_intf_ports adc0_clk] [get_bd_intf_pins RFDataConverter/adc0_clk]
connect_bd_intf_net [get_bd_intf_ports adc1_clk] [get_bd_intf_pins RFDataConverter/adc1_clk]
connect_bd_intf_net [get_bd_intf_ports adc2_clk] [get_bd_intf_pins RFDataConverter/adc2_clk]
connect_bd_intf_net [get_bd_intf_ports adc3_clk] [get_bd_intf_pins RFDataConverter/adc3_clk]
connect_bd_intf_net [get_bd_intf_pins axi4_stream_to_software_dma_s2mm/m_dest_axi] [get_bd_intf_pins axi_intc_hp0/S00_AXI]
connect_bd_intf_net [get_bd_intf_pins zynq_ultra_ps/S_AXI_HP0_FPD] [get_bd_intf_pins axi_intc_hp0/M00_AXI]
connect_bd_intf_net [get_bd_intf_pins axi4_stream_to_software_dma_s2mm/s_axi] [get_bd_intf_pins axi_intc_reg/M00_AXI]
connect_bd_intf_net [get_bd_intf_pins dvbs2_ip/AXI4_Lite] [get_bd_intf_pins axi_intc_reg/M01_AXI]
connect_bd_intf_net [get_bd_intf_pins RFDataConverter/s_axi] [get_bd_intf_pins axi_intc_reg/M02_AXI]
connect_bd_intf_net [get_bd_intf_ports dac0_clk] [get_bd_intf_pins RFDataConverter/dac0_clk]
connect_bd_intf_net [get_bd_intf_ports dac1_clk] [get_bd_intf_pins RFDataConverter/dac1_clk]
connect_bd_intf_net [get_bd_intf_pins dvbs2_ip/AXI4_Stream_0_Master] [get_bd_intf_pins axi4_stream_to_software_dma_s2mm/s_axis]
connect_bd_intf_net [get_bd_intf_pins jtag_axi/axi4m] [get_bd_intf_pins axi_intc_reg/S01_AXI]
connect_bd_intf_net -intf_net vin0_01_1 [get_bd_intf_ports vin0_01] [get_bd_intf_pins RFDataConverter/vin0_01]
connect_bd_intf_net -intf_net vin0_23_1 [get_bd_intf_ports vin0_23] [get_bd_intf_pins RFDataConverter/vin0_23]
connect_bd_intf_net -intf_net vin1_01_1 [get_bd_intf_ports vin1_01] [get_bd_intf_pins RFDataConverter/vin1_01]
connect_bd_intf_net -intf_net vin1_23_1 [get_bd_intf_ports vin1_23] [get_bd_intf_pins RFDataConverter/vin1_23]
connect_bd_intf_net -intf_net vin2_01_1 [get_bd_intf_ports vin2_01] [get_bd_intf_pins RFDataConverter/vin2_01]
connect_bd_intf_net -intf_net vin2_23_1 [get_bd_intf_ports vin2_23] [get_bd_intf_pins RFDataConverter/vin2_23]
connect_bd_intf_net -intf_net vin3_01_1 [get_bd_intf_ports vin3_01] [get_bd_intf_pins RFDataConverter/vin3_01]
connect_bd_intf_net -intf_net vin3_23_1 [get_bd_intf_ports vin3_23] [get_bd_intf_pins RFDataConverter/vin3_23]
connect_bd_intf_net [get_bd_intf_pins zynq_ultra_ps/M_AXI_HPM0_FPD] [get_bd_intf_pins axi_intc_reg/S00_AXI]
connect_bd_net [get_bd_pins ADC_Demuxer_0/IQ_Valid] [get_bd_pins dvbs2_ip/rxvalidIn]
connect_bd_net [get_bd_pins ADC_Demuxer_0/I_Out] [get_bd_pins dvbs2_ip/rxdataInI]
connect_bd_net [get_bd_pins ADC_Demuxer_0/Q_Out] [get_bd_pins dvbs2_ip/rxdataInQ]
connect_bd_net [get_bd_pins DAC_Muxer_0/DAC] [get_bd_pins RFDataConverter/s00_axis_tdata]
connect_bd_net [get_bd_pins DAC_Muxer_0/ValidOut] [get_bd_pins RFDataConverter/s00_axis_tvalid]
connect_bd_net [get_bd_pins DAC_Muxer_1/DAC] [get_bd_pins RFDataConverter/s01_axis_tdata]
connect_bd_net [get_bd_pins DAC_Muxer_1/ValidOut] [get_bd_pins RFDataConverter/s01_axis_tvalid]
connect_bd_net [get_bd_pins DAC_Muxer_2/DAC] [get_bd_pins RFDataConverter/s02_axis_tdata]
connect_bd_net [get_bd_pins DAC_Muxer_2/ValidOut] [get_bd_pins RFDataConverter/s02_axis_tvalid]
connect_bd_net [get_bd_pins DAC_Muxer_3/DAC] [get_bd_pins RFDataConverter/s03_axis_tdata]
connect_bd_net [get_bd_pins DAC_Muxer_3/ValidOut] [get_bd_pins RFDataConverter/s03_axis_tvalid]
connect_bd_net [get_bd_pins DAC_Muxer_4/DAC] [get_bd_pins RFDataConverter/s10_axis_tdata]
connect_bd_net [get_bd_pins DAC_Muxer_4/ValidOut] [get_bd_pins RFDataConverter/s10_axis_tvalid]
connect_bd_net [get_bd_pins DAC_Muxer_5/DAC] [get_bd_pins RFDataConverter/s11_axis_tdata]
connect_bd_net [get_bd_pins DAC_Muxer_5/ValidOut] [get_bd_pins RFDataConverter/s11_axis_tvalid]
connect_bd_net [get_bd_pins DAC_Muxer_6/DAC] [get_bd_pins RFDataConverter/s12_axis_tdata]
connect_bd_net [get_bd_pins DAC_Muxer_6/ValidOut] [get_bd_pins RFDataConverter/s12_axis_tvalid]
connect_bd_net [get_bd_pins DAC_Muxer_7/DAC] [get_bd_pins RFDataConverter/s13_axis_tdata]
connect_bd_net [get_bd_pins DAC_Muxer_7/ValidOut] [get_bd_pins RFDataConverter/s13_axis_tvalid]
connect_bd_net [get_bd_pins RFDataConverter/clk_adc0] [get_bd_pins rfDCStreamClkGen/clk_in1]
connect_bd_net [get_bd_pins RFDataConverter/m00_axis_tdata] [get_bd_pins ADC_Demuxer_0/I_In]
connect_bd_net [get_bd_pins RFDataConverter/m00_axis_tvalid] [get_bd_pins ADC_Demuxer_0/I_Valid]
connect_bd_net [get_bd_pins RFDataConverter/m01_axis_tdata] [get_bd_pins ADC_Demuxer_0/Q_In]
connect_bd_net [get_bd_pins RFDataConverter/m01_axis_tvalid] [get_bd_pins ADC_Demuxer_0/Q_Valid]
connect_bd_net [get_bd_pins RFDataConverter/m02_axis_tdata] [get_bd_pins ADC_Demuxer_1/I_In]
connect_bd_net [get_bd_pins RFDataConverter/m02_axis_tvalid] [get_bd_pins ADC_Demuxer_1/I_Valid]
connect_bd_net [get_bd_pins RFDataConverter/m03_axis_tdata] [get_bd_pins ADC_Demuxer_1/Q_In]
connect_bd_net [get_bd_pins RFDataConverter/m03_axis_tvalid] [get_bd_pins ADC_Demuxer_1/Q_Valid]
connect_bd_net [get_bd_pins RFDataConverter/m10_axis_tdata] [get_bd_pins ADC_Demuxer_2/I_In]
connect_bd_net [get_bd_pins RFDataConverter/m10_axis_tvalid] [get_bd_pins ADC_Demuxer_2/I_Valid]
connect_bd_net [get_bd_pins RFDataConverter/m11_axis_tdata] [get_bd_pins ADC_Demuxer_2/Q_In]
connect_bd_net [get_bd_pins RFDataConverter/m11_axis_tvalid] [get_bd_pins ADC_Demuxer_2/Q_Valid]
connect_bd_net [get_bd_pins RFDataConverter/m12_axis_tdata] [get_bd_pins ADC_Demuxer_3/I_In]
connect_bd_net [get_bd_pins RFDataConverter/m12_axis_tvalid] [get_bd_pins ADC_Demuxer_3/I_Valid]
connect_bd_net [get_bd_pins RFDataConverter/m13_axis_tdata] [get_bd_pins ADC_Demuxer_3/Q_In]
connect_bd_net [get_bd_pins RFDataConverter/m13_axis_tvalid] [get_bd_pins ADC_Demuxer_3/Q_Valid]
connect_bd_net [get_bd_pins RFDataConverter/m20_axis_tdata] [get_bd_pins ADC_Demuxer_4/I_In]
connect_bd_net [get_bd_pins RFDataConverter/m20_axis_tvalid] [get_bd_pins ADC_Demuxer_4/I_Valid]
connect_bd_net [get_bd_pins RFDataConverter/m21_axis_tdata] [get_bd_pins ADC_Demuxer_4/Q_In]
connect_bd_net [get_bd_pins RFDataConverter/m21_axis_tvalid] [get_bd_pins ADC_Demuxer_4/Q_Valid]
connect_bd_net [get_bd_pins RFDataConverter/m22_axis_tdata] [get_bd_pins ADC_Demuxer_5/I_In]
connect_bd_net [get_bd_pins RFDataConverter/m22_axis_tvalid] [get_bd_pins ADC_Demuxer_5/I_Valid]
connect_bd_net [get_bd_pins RFDataConverter/m23_axis_tdata] [get_bd_pins ADC_Demuxer_5/Q_In]
connect_bd_net [get_bd_pins RFDataConverter/m23_axis_tvalid] [get_bd_pins ADC_Demuxer_5/Q_Valid]
connect_bd_net [get_bd_pins RFDataConverter/m30_axis_tdata] [get_bd_pins ADC_Demuxer_6/I_In]
connect_bd_net [get_bd_pins RFDataConverter/m30_axis_tvalid] [get_bd_pins ADC_Demuxer_6/I_Valid]
connect_bd_net [get_bd_pins RFDataConverter/m31_axis_tdata] [get_bd_pins ADC_Demuxer_6/Q_In]
connect_bd_net [get_bd_pins RFDataConverter/m31_axis_tvalid] [get_bd_pins ADC_Demuxer_6/Q_Valid]
connect_bd_net [get_bd_pins RFDataConverter/m32_axis_tdata] [get_bd_pins ADC_Demuxer_7/I_In]
connect_bd_net [get_bd_pins RFDataConverter/m32_axis_tvalid] [get_bd_pins ADC_Demuxer_7/I_Valid]
connect_bd_net [get_bd_pins RFDataConverter/m33_axis_tdata] [get_bd_pins ADC_Demuxer_7/Q_In]
connect_bd_net [get_bd_pins RFDataConverter/m33_axis_tvalid] [get_bd_pins ADC_Demuxer_7/Q_Valid]
connect_bd_net [get_bd_pins axi4_stream_to_software_dma_s2mm/irq] [get_bd_pins interrupt_concat/In0]
connect_bd_net [get_bd_pins clkgen/clk_out1] \
  [get_bd_pins sys_rstgen/slowest_sync_clk] [get_bd_pins axi4_stream_to_software_dma_s2mm/s_axi_aclk] \
  [get_bd_pins jtag_axi/aclk] [get_bd_pins zynq_ultra_ps/maxihpm0_fpd_aclk] [get_bd_pins zynq_ultra_ps/maxihpm1_fpd_aclk] \
  [get_bd_pins RFDataConverter/s_axi_aclk] [get_bd_pins axi_intc_reg/ACLK] [get_bd_pins axi_intc_reg/S00_ACLK] \
  [get_bd_pins axi_intc_reg/S01_ACLK] [get_bd_pins axi_intc_reg/M00_ACLK] [get_bd_pins axi_intc_reg/M02_ACLK]
connect_bd_net [get_bd_pins clkgen/clk_out2] \
  [get_bd_pins mem_rstgen/slowest_sync_clk] [get_bd_pins axi4_stream_to_software_dma_s2mm/m_dest_axi_aclk] \
  [get_bd_pins zynq_ultra_ps/saxihp0_fpd_aclk] [get_bd_pins zynq_ultra_ps/saxihp1_fpd_aclk] [get_bd_pins axi_intc_hp0/ACLK] \
  [get_bd_pins axi_intc_hp0/S00_ACLK] [get_bd_pins axi_intc_hp0/M00_ACLK]
connect_bd_net [get_bd_pins dvbs2_ip/txdataIOut] [get_bd_pins DAC_Muxer_6/DACLowerBits0]
connect_bd_net [get_bd_pins dvbs2_ip/txdataQOut] [get_bd_pins DAC_Muxer_6/DACLowerBits1]
connect_bd_net [get_bd_pins dvbs2_ip/txvalidOut] [get_bd_pins DAC_Muxer_6/ValidIn]
connect_bd_net [get_bd_pins interrupt_concat/dout] [get_bd_pins zynq_ultra_ps/pl_ps_irq0]
connect_bd_net [get_bd_pins ipcore_rstgen/peripheral_aresetn] \
  [get_bd_pins dvbs2_ip/IPCORE_RESETN] [get_bd_pins dvbs2_ip/AXI4_Lite_ARESETN] [get_bd_pins RFDataConverter/m0_axis_aresetn] \
  [get_bd_pins RFDataConverter/m1_axis_aresetn] [get_bd_pins RFDataConverter/m2_axis_aresetn] \
  [get_bd_pins RFDataConverter/m3_axis_aresetn] [get_bd_pins RFDataConverter/s0_axis_aresetn] \
  [get_bd_pins RFDataConverter/s1_axis_aresetn] [get_bd_pins axi_intc_reg/M01_ARESETN]
connect_bd_net [get_bd_pins mem_rstgen/interconnect_aresetn] [get_bd_pins axi_intc_hp0/ARESETN]
connect_bd_net [get_bd_pins mem_rstgen/peripheral_aresetn] \
  [get_bd_pins axi4_stream_to_software_dma_s2mm/m_dest_axi_aresetn] [get_bd_pins axi_intc_hp0/S00_ARESETN] \
  [get_bd_pins axi_intc_hp0/M00_ARESETN]
connect_bd_net [get_bd_pins rfDCStreamClkGen/clk_out1] \
  [get_bd_pins ipcore_rstgen/slowest_sync_clk] [get_bd_pins axi4_stream_to_software_dma_s2mm/s_axis_aclk] \
  [get_bd_pins dvbs2_ip/IPCORE_CLK] [get_bd_pins dvbs2_ip/AXI4_Lite_ACLK] [get_bd_pins RFDataConverter/m0_axis_aclk] \
  [get_bd_pins RFDataConverter/m1_axis_aclk] [get_bd_pins RFDataConverter/m2_axis_aclk] \
  [get_bd_pins RFDataConverter/m3_axis_aclk] [get_bd_pins RFDataConverter/s0_axis_aclk] \
  [get_bd_pins RFDataConverter/s1_axis_aclk] [get_bd_pins axi_intc_reg/M01_ACLK]
connect_bd_net [get_bd_pins sys_rstgen/interconnect_aresetn] [get_bd_pins axi_intc_reg/ARESETN]
connect_bd_net [get_bd_pins sys_rstgen/peripheral_aresetn] \
  [get_bd_pins axi4_stream_to_software_dma_s2mm/s_axi_aresetn] [get_bd_pins jtag_axi/aresetn] \
  [get_bd_pins RFDataConverter/s_axi_aresetn] [get_bd_pins axi_intc_reg/S00_ARESETN] [get_bd_pins axi_intc_reg/S01_ARESETN] \
  [get_bd_pins axi_intc_reg/M00_ARESETN] [get_bd_pins axi_intc_reg/M02_ARESETN]
connect_bd_net [get_bd_pins zynq_ultra_ps/pl_clk0] [get_bd_pins clkgen/clk_in1]
connect_bd_net [get_bd_pins zynq_ultra_ps/pl_resetn0] \
  [get_bd_pins sys_rstgen/ext_reset_in] [get_bd_pins ipcore_rstgen/ext_reset_in] [get_bd_pins mem_rstgen/ext_reset_in]

# ---- address map ----
assign_bd_address -offset 0x00000000 -range 2G -target_address_space [get_bd_addr_spaces axi4_stream_to_software_dma_s2mm/m_dest_axi] [get_bd_addr_segs zynq_ultra_ps/SAXIGP2/HP0_DDR_LOW]
assign_bd_address -offset 0x00A0000000 -range 64K -target_address_space [get_bd_addr_spaces jtag_axi/axi4m] [get_bd_addr_segs dvbs2_ip/AXI4_Lite/reg0]
assign_bd_address -offset 0x00A0010000 -range 64K -target_address_space [get_bd_addr_spaces jtag_axi/axi4m] [get_bd_addr_segs axi4_stream_to_software_dma_s2mm/s_axi/axi_lite]
assign_bd_address -offset 0x00A3C00000 -range 256K -target_address_space [get_bd_addr_spaces jtag_axi/axi4m] [get_bd_addr_segs RFDataConverter/s_axi/Reg]
assign_bd_address -offset 0x00A0000000 -range 64K -target_address_space [get_bd_addr_spaces zynq_ultra_ps/Data] [get_bd_addr_segs dvbs2_ip/AXI4_Lite/reg0]
assign_bd_address -offset 0x00A0010000 -range 64K -target_address_space [get_bd_addr_spaces zynq_ultra_ps/Data] [get_bd_addr_segs axi4_stream_to_software_dma_s2mm/s_axi/axi_lite]
assign_bd_address -offset 0x00A3C00000 -range 256K -target_address_space [get_bd_addr_spaces zynq_ultra_ps/Data] [get_bd_addr_segs RFDataConverter/s_axi/Reg]

validate_bd_design
save_bd_design
